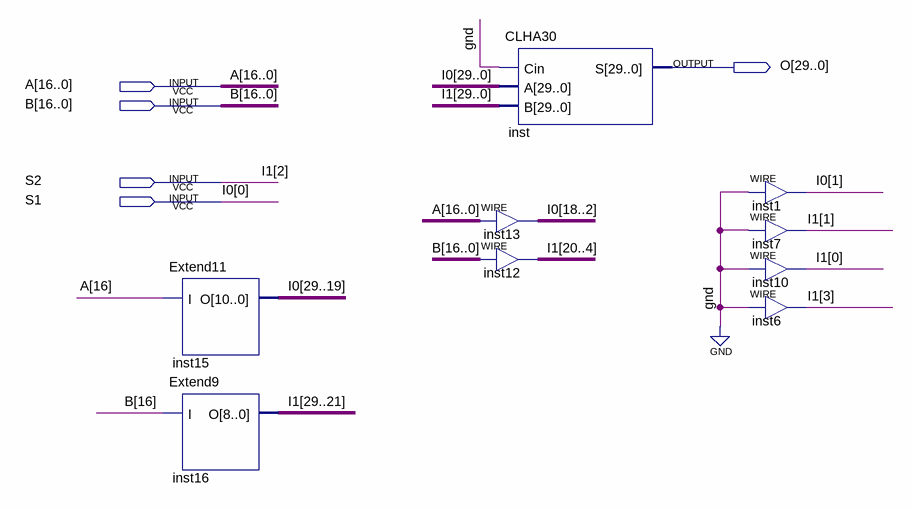
[diagram p0: schematic sheet]
// Quartus schematic R2R3.bdf as structural Verilog: 9 symbols, 5 pins
module R2R3 (
  input  [16:0] A,
  input  [16:0] B,
  input  S2,
  input  S1,
  output [29:0] O
);

  wire [29:0] I1;
  wire [29:1] I0;

  Extend11 inst15 (.I(A[16]), .O(I0[29:19]));
  Extend9 inst16 (.I(B[16]), .O(I1[29:21]));
  CLHA30 inst (.Cin(1'b0), .A({I0, S1}), .B({I1[29:3], S2, I1[1:0]}), .S(O));
  assign I0[18:2] = A;  // WIRE inst13
  assign I1[20:4] = B;  // WIRE inst12
  assign I0[1] = 1'b0;  // WIRE inst1
  assign I1[1] = 1'b0;  // WIRE inst7
  assign I1[0] = 1'b0;  // WIRE inst10
  assign I1[3] = 1'b0;  // WIRE inst6

  // Other names for the same wires on the sheet: I0[0] = S1; I1[2] = S2
endmodule
